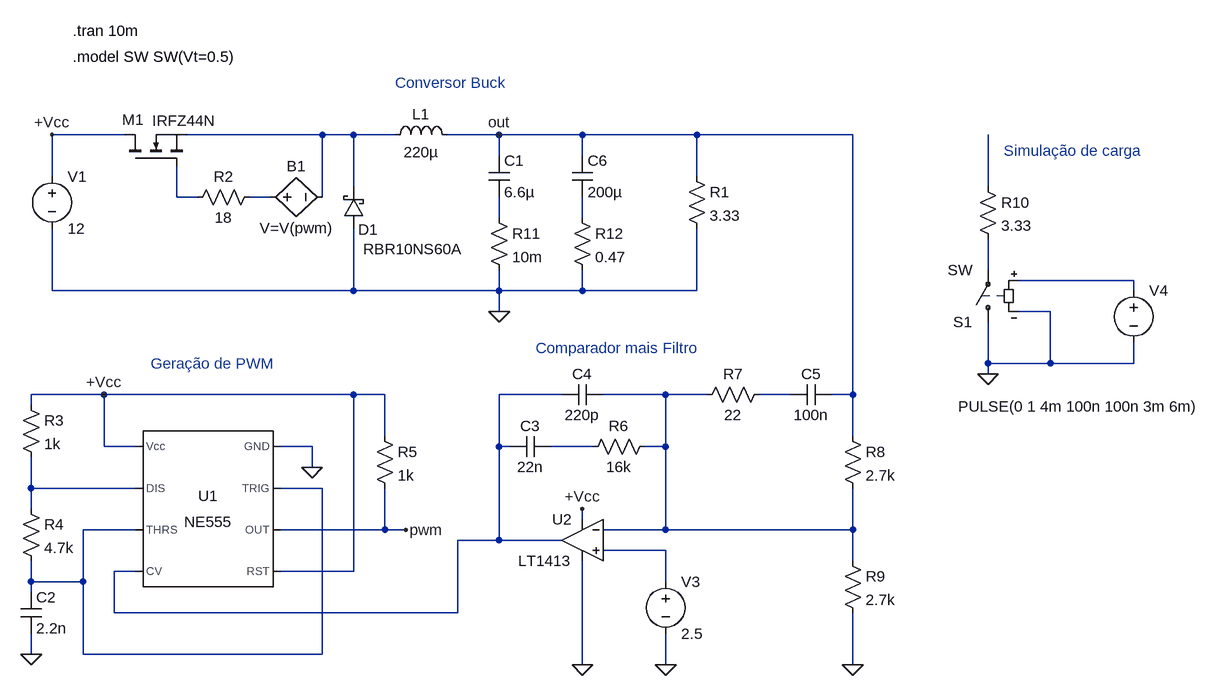
[diagram p0: schematic Buck_Com_555.asc]
Buck_Com_555.asc, the LTspice schematic file:
Version 4.1
SHEET 1 2036 996
WIRE -240 96 -352 96
WIRE 64 96 -144 96
WIRE 112 96 64 96
WIRE 176 96 112 96
WIRE 336 96 256 96
WIRE 464 96 336 96
WIRE 640 96 464 96
WIRE 880 96 640 96
WIRE 336 128 336 96
WIRE 464 128 464 96
WIRE -352 160 -352 96
WIRE 640 160 640 96
WIRE 112 176 112 96
WIRE 1088 176 1088 96
WIRE -160 192 -160 144
WIRE -128 192 -160 192
WIRE -16 192 -48 192
WIRE 64 192 64 96
WIRE 336 224 336 192
WIRE 464 224 464 192
WIRE 1088 304 1088 256
WIRE 1312 320 1136 320
WIRE -352 336 -352 240
WIRE 112 336 112 240
WIRE 112 336 -352 336
WIRE 336 336 336 304
WIRE 336 336 112 336
WIRE 464 336 464 304
WIRE 464 336 336 336
WIRE 640 336 640 240
WIRE 640 336 464 336
WIRE 1312 336 1312 320
WIRE 336 368 336 336
WIRE 1184 368 1136 368
WIRE 1088 448 1088 384
WIRE 1184 448 1184 368
WIRE 1184 448 1088 448
WIRE 1312 448 1312 416
WIRE 1312 448 1184 448
WIRE 1088 464 1088 448
WIRE -272 496 -384 496
WIRE 112 496 -272 496
WIRE 160 496 112 496
WIRE 432 496 336 496
WIRE 592 496 496 496
WIRE 656 496 592 496
WIRE 784 496 736 496
WIRE 880 496 880 96
WIRE 880 496 848 496
WIRE -384 512 -384 496
WIRE 160 560 160 496
WIRE 880 560 880 496
WIRE -272 576 -272 496
WIRE -224 576 -272 576
WIRE 48 576 0 576
WIRE 336 576 336 496
WIRE 352 576 336 576
WIRE 480 576 416 576
WIRE 592 576 592 496
WIRE 592 576 560 576
WIRE 48 608 48 576
WIRE -384 640 -384 592
WIRE -224 640 -384 640
WIRE 64 640 0 640
WIRE -384 672 -384 640
WIRE 464 688 464 672
WIRE -224 704 -304 704
WIRE 160 704 160 640
WIRE 160 704 0 704
WIRE 192 704 160 704
WIRE 592 704 592 576
WIRE 592 704 496 704
WIRE 880 704 880 640
WIRE 880 704 592 704
WIRE 336 720 336 576
WIRE 336 720 272 720
WIRE 432 720 336 720
WIRE 592 736 496 736
WIRE 880 752 880 704
WIRE -224 768 -256 768
WIRE 112 768 112 496
WIRE 112 768 0 768
WIRE -384 784 -384 752
WIRE -304 784 -304 704
WIRE -304 784 -384 784
WIRE 592 784 592 736
WIRE -384 800 -384 784
WIRE -256 832 -256 768
WIRE 272 832 272 720
WIRE 272 832 -256 832
WIRE -384 896 -384 864
WIRE -304 896 -304 784
WIRE 64 896 64 640
WIRE 64 896 -304 896
WIRE 464 912 464 752
WIRE 592 912 592 864
WIRE 880 912 880 832
FLAG -384 896 0
FLAG 48 608 0
FLAG 192 704 pwm
FLAG 880 912 0
FLAG 336 368 0
FLAG -272 496 +Vcc
FLAG 592 912 0
FLAG 464 912 0
FLAG 464 672 +Vcc
FLAG 1088 464 0
FLAG 336 96 out
FLAG -352 96 +Vcc
SYMBOL Misc\\NE555 -112 672 M0
SYMATTR InstName U1
SYMBOL res -400 496 R0
SYMATTR InstName R3
SYMATTR Value 1k
SYMBOL cap -400 800 R0
SYMATTR InstName C2
SYMATTR Value 2.2n
SYMBOL res -400 656 R0
SYMATTR InstName R4
SYMATTR Value 4.7k
SYMBOL res 144 544 R0
SYMATTR InstName R5
SYMATTR Value 1k
SYMBOL res 864 544 R0
SYMATTR InstName R8
SYMATTR Value 2.7k
SYMBOL res 864 736 R0
SYMATTR InstName R9
SYMATTR Value 2.7k
SYMBOL ind 160 112 R270
WINDOW 0 32 56 VTop 2
WINDOW 3 5 56 VBottom 2
SYMATTR InstName L1
SYMATTR Value 220µ
SYMBOL cap 320 128 R0
SYMATTR InstName C1
SYMATTR Value 6.6µ
SYMBOL res 624 144 R0
SYMATTR InstName R1
SYMATTR Value 3.33
SYMBOL voltage -352 144 R0
WINDOW 123 0 0 Left 0
WINDOW 39 0 0 Left 0
SYMATTR InstName V1
SYMATTR Value 12
SYMBOL schottky 128 240 R180
WINDOW 0 -22 -2 Left 2
WINDOW 3 -152 -32 Left 2
SYMATTR InstName D1
SYMATTR Value RBR10NS60A
SYMATTR Description Diode
SYMATTR Type diode
SYMBOL bv -32 192 R270
WINDOW 0 32 56 VTop 2
WINDOW 3 -32 56 VBottom 2
SYMATTR InstName B1
SYMATTR Value V=V(pwm)
SYMBOL res -32 176 R90
WINDOW 0 0 56 VBottom 2
WINDOW 3 32 56 VTop 2
SYMATTR InstName R2
SYMATTR Value 18
SYMBOL nmos -240 144 R270
WINDOW 0 71 -4 VRight 2
WINDOW 3 70 42 VRight 2
SYMATTR InstName M1
SYMATTR Value IRFZ44N
SYMBOL voltage 592 768 R0
WINDOW 123 0 0 Left 0
WINDOW 39 0 0 Left 0
SYMATTR InstName V3
SYMATTR Value 2.5
SYMBOL res 576 560 R90
WINDOW 0 0 56 VBottom 2
WINDOW 3 32 56 VTop 2
SYMATTR InstName R6
SYMATTR Value 16k
SYMBOL cap 416 560 R90
WINDOW 0 0 32 VBottom 2
WINDOW 3 32 32 VTop 2
SYMATTR InstName C3
SYMATTR Value 22n
SYMBOL cap 496 480 R90
WINDOW 0 0 32 VBottom 2
WINDOW 3 32 32 VTop 2
SYMATTR InstName C4
SYMATTR Value 220p
SYMBOL OpAmps\\LT1413 464 656 M0
SYMATTR InstName U2
SYMBOL res 752 480 R90
WINDOW 0 0 56 VBottom 2
WINDOW 3 32 56 VTop 2
SYMATTR InstName R7
SYMATTR Value 22
SYMBOL cap 848 480 R90
WINDOW 0 0 32 VBottom 2
WINDOW 3 32 32 VTop 2
SYMATTR InstName C5
SYMATTR Value 100n
SYMBOL res 1072 160 R0
SYMATTR InstName R10
SYMATTR Value 3.33
SYMBOL sw 1088 400 R180
SYMATTR InstName S1
SYMBOL voltage 1312 320 R0
WINDOW 123 0 0 Left 0
WINDOW 39 0 0 Left 0
WINDOW 3 -270 194 Left 2
SYMATTR Value PULSE(0 1 4m 100n 100n 3m 6m)
SYMATTR InstName V4
SYMBOL res 320 208 R0
SYMATTR InstName R11
SYMATTR Value 10m
SYMBOL cap 448 128 R0
SYMATTR InstName C6
SYMATTR Value 200µ
SYMBOL res 448 208 R0
SYMATTR InstName R12
SYMATTR Value 0.47
TEXT -320 -64 Left 2 !.tran 10m
TEXT -320 -24 Left 2 !.model SW SW(Vt=0.5)
TEXT 176 16 Left 2 ;Conversor Buck
TEXT -200 448 Left 2 ;Geração de PWM
TEXT 392 424 Left 2 ;Comparador mais Filtro
TEXT 1112 120 Left 2 ;Simulação de carga

The netlist it stands for:
* Buck_Com_555.asc
X§U1 0 N014 pwm +Vcc N009 N014 N013 +Vcc NE555  ; pins GND TRIG OUT RST CV THRS DIS Vcc
R3 +Vcc N013 1k
C2 N014 0 2.2n
R4 N013 N014 4.7k
R5 +Vcc pwm 1k
R8 out N010 2.7k
R9 N010 0 2.7k
L1 N001 out 220µ
C1 out N005 6.6µ
R1 out 0 3.33
V1 +Vcc 0 12
D1 0 N001 RBR10NS60A
B1 N004 N001 V=V(pwm)
R2 N004 N003 18
M1 +Vcc N003 N001 N001 IRFZ44N
V3 N015 0 2.5
R6 N010 N012 16k
C3 N012 N009 22n
C4 N010 N009 220p
X§U2 N015 N010 +Vcc 0 N009 LT1413  ; pins In+ In- V+ V- OUT
R7 N011 N010 22
C5 out N011 100n
R10 N002 N007 3.33
S1 0 N007 N008 0 SW
V4 N008 0 PULSE(0 1 4m 100n 100n 3m 6m)
R11 N005 0 10m
C6 out N006 200µ
R12 N006 0 0.47
.model D D
.lib standard.dio
.model NMOS NMOS
.model PMOS PMOS
.lib standard.mos
.tran 10m
.model SW SW(Vt=0.5)
* Conversor Buck
* Geração de PWM
* Comparador mais Filtro
* Simulação de carga
.lib NE555.sub
.lib LTC.lib
.backanno
.end